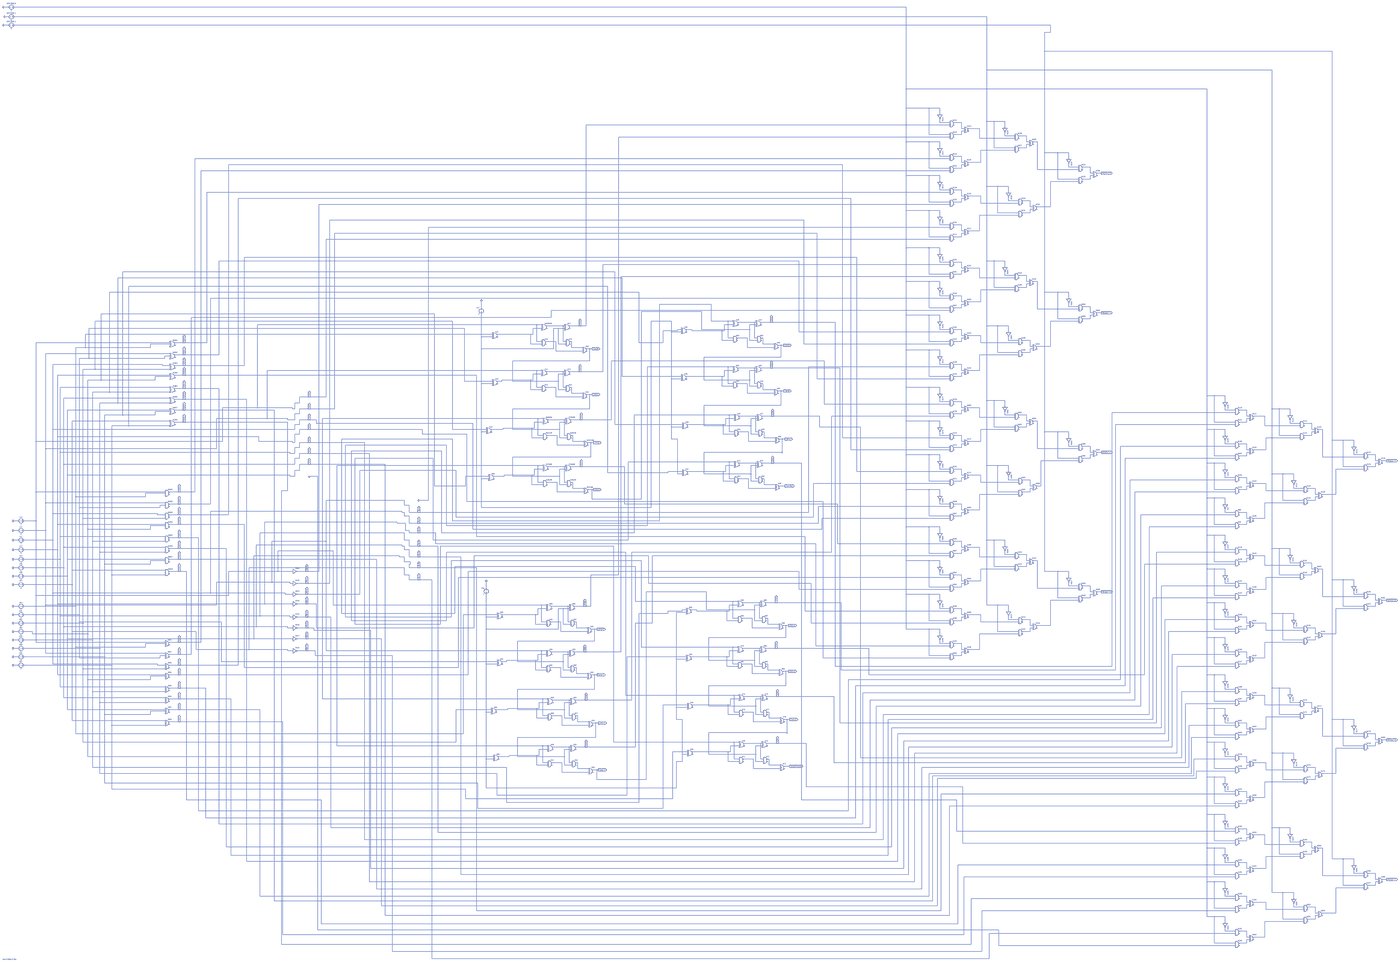
[diagram p0: schematic ALU.asc, whole sheet]
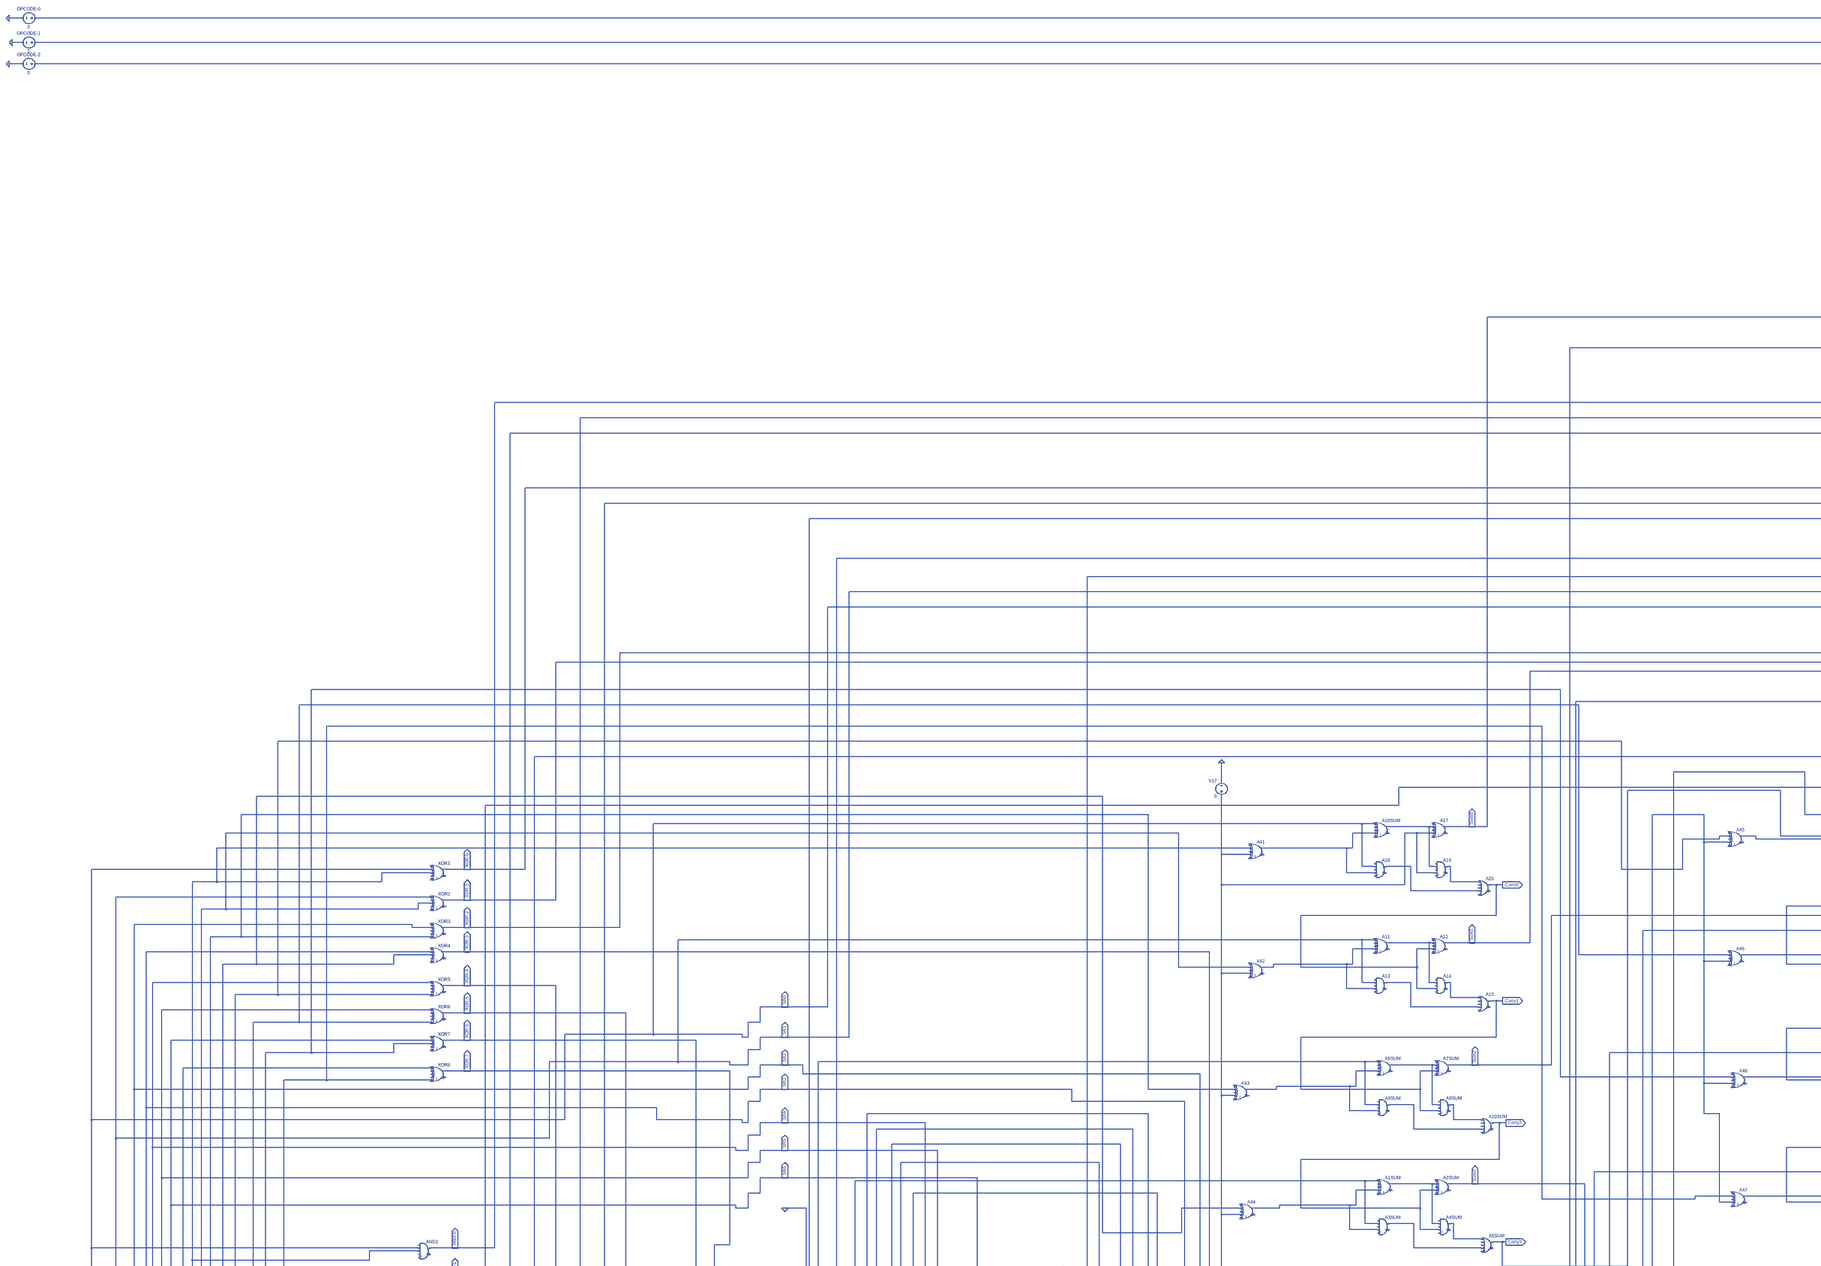
[diagram p1: schematic ALU.asc, part, row 1 of 2, column 1 of 2]
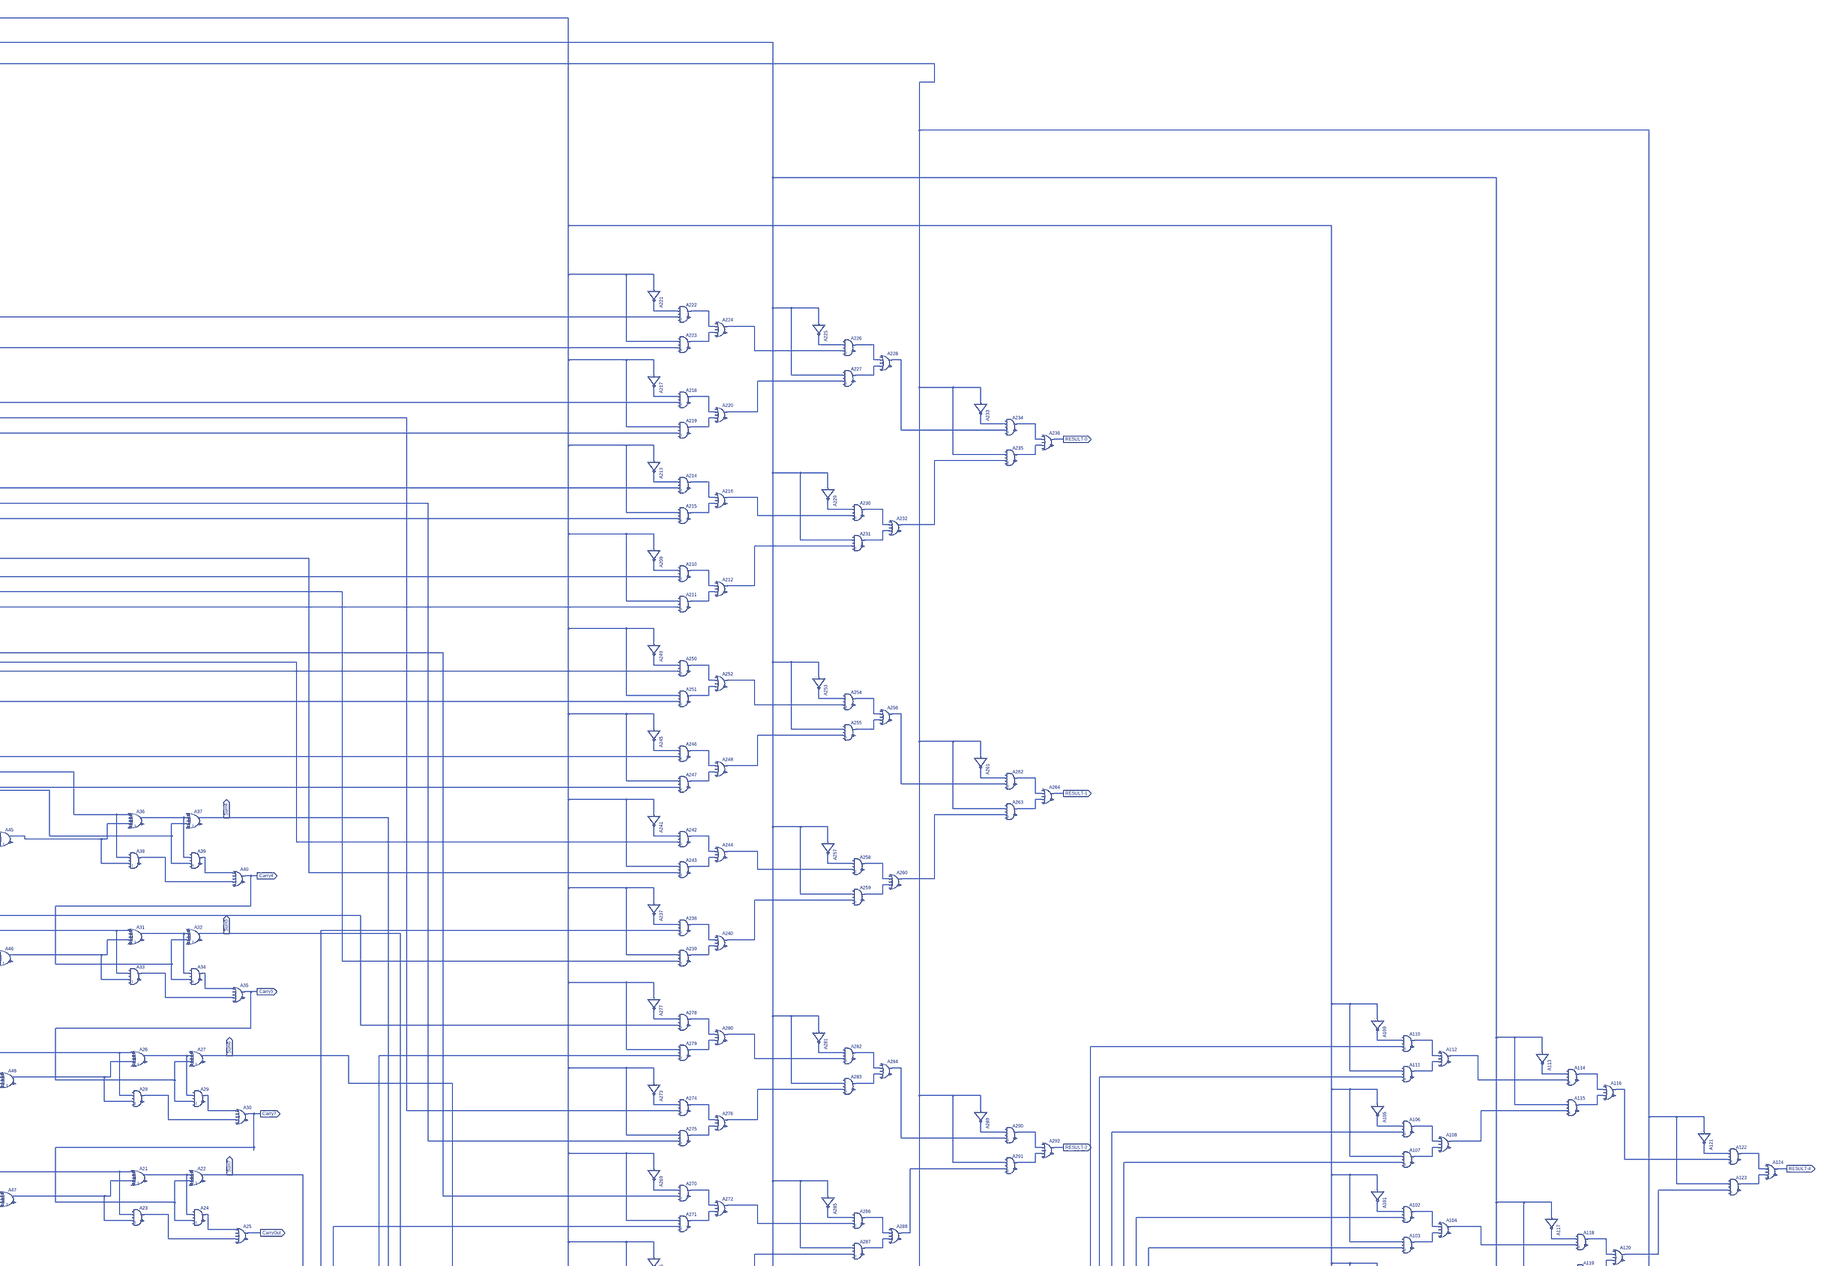
[diagram p2: schematic ALU.asc, part, row 1 of 2, column 2 of 2]
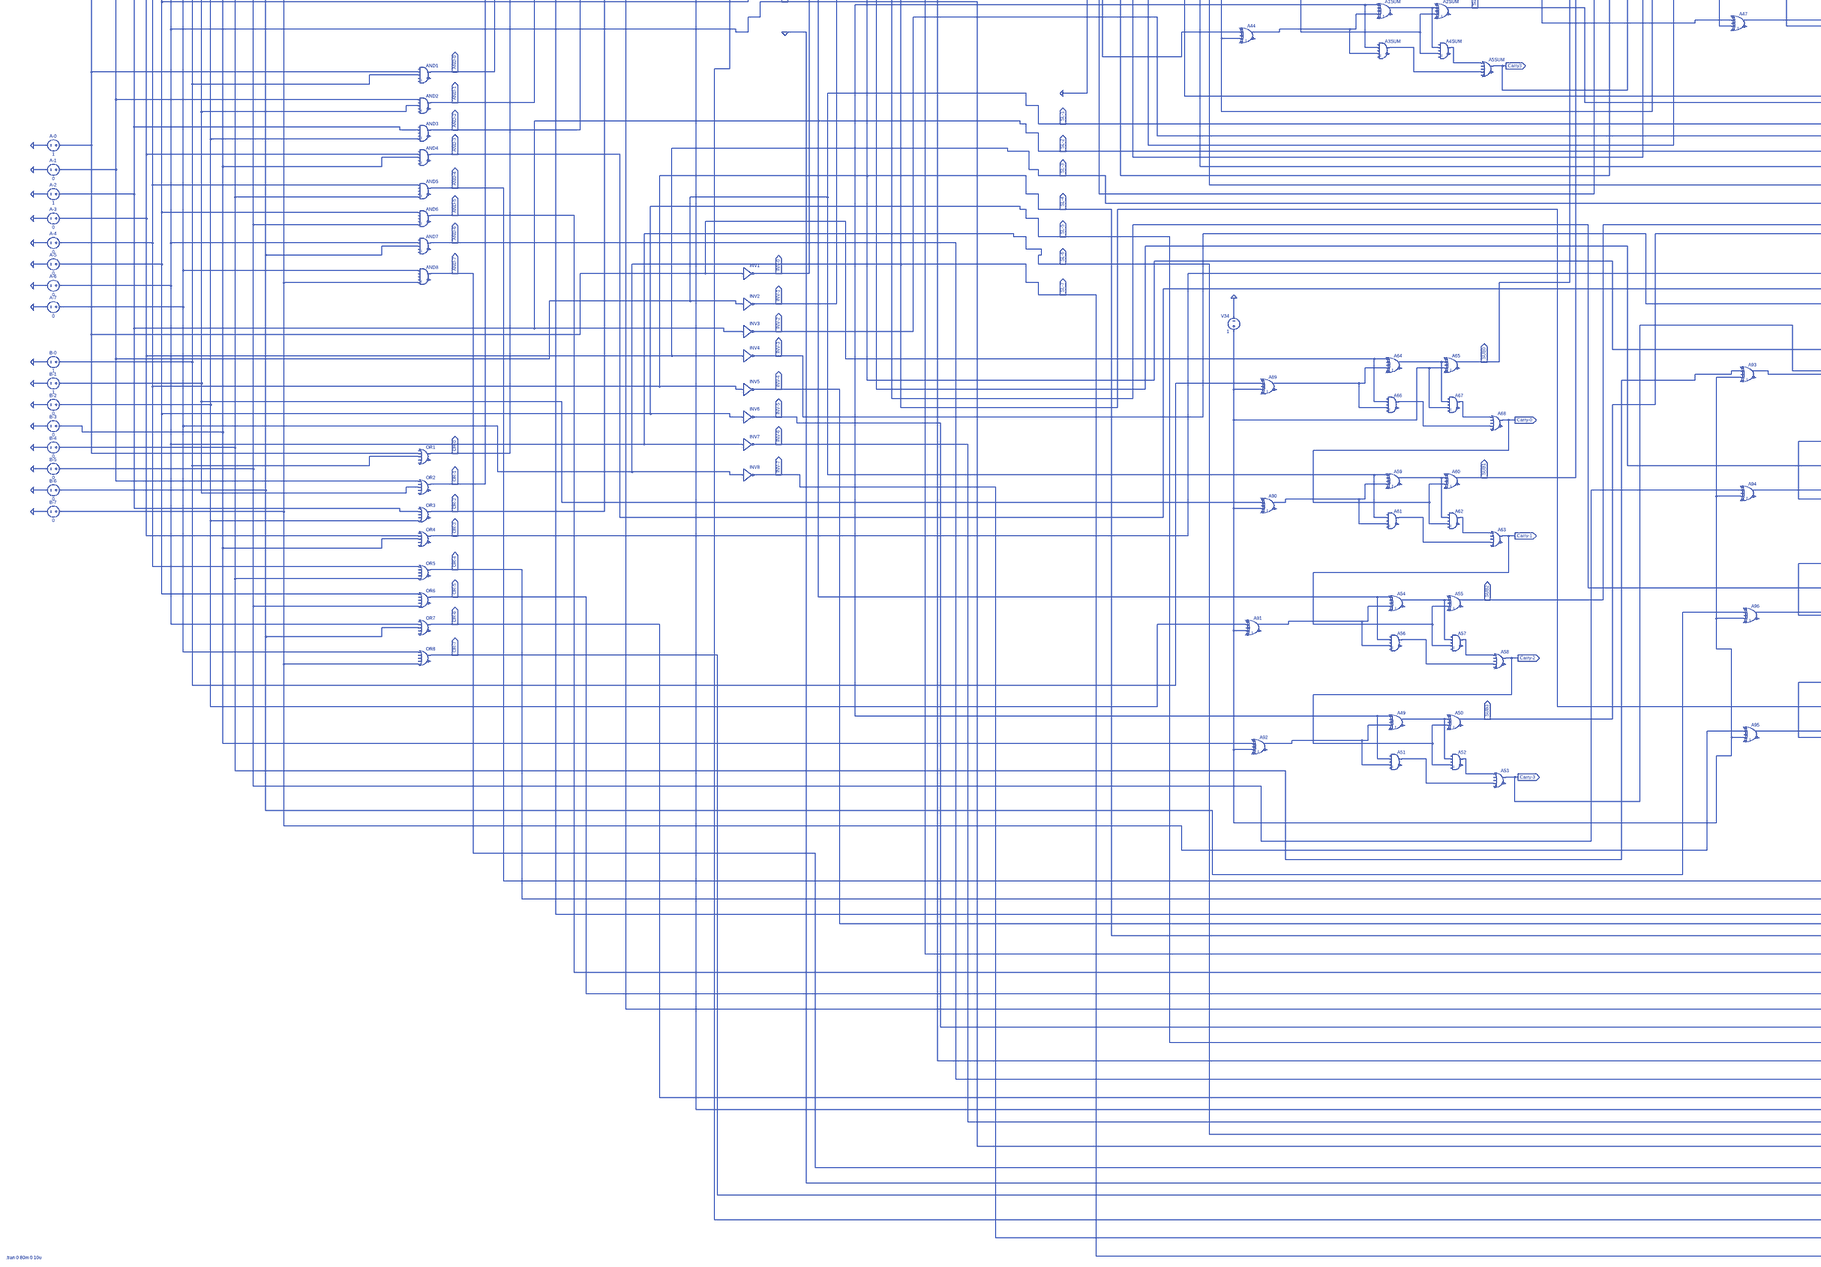
[diagram p3: schematic ALU.asc, part, row 2 of 2, column 1 of 2]
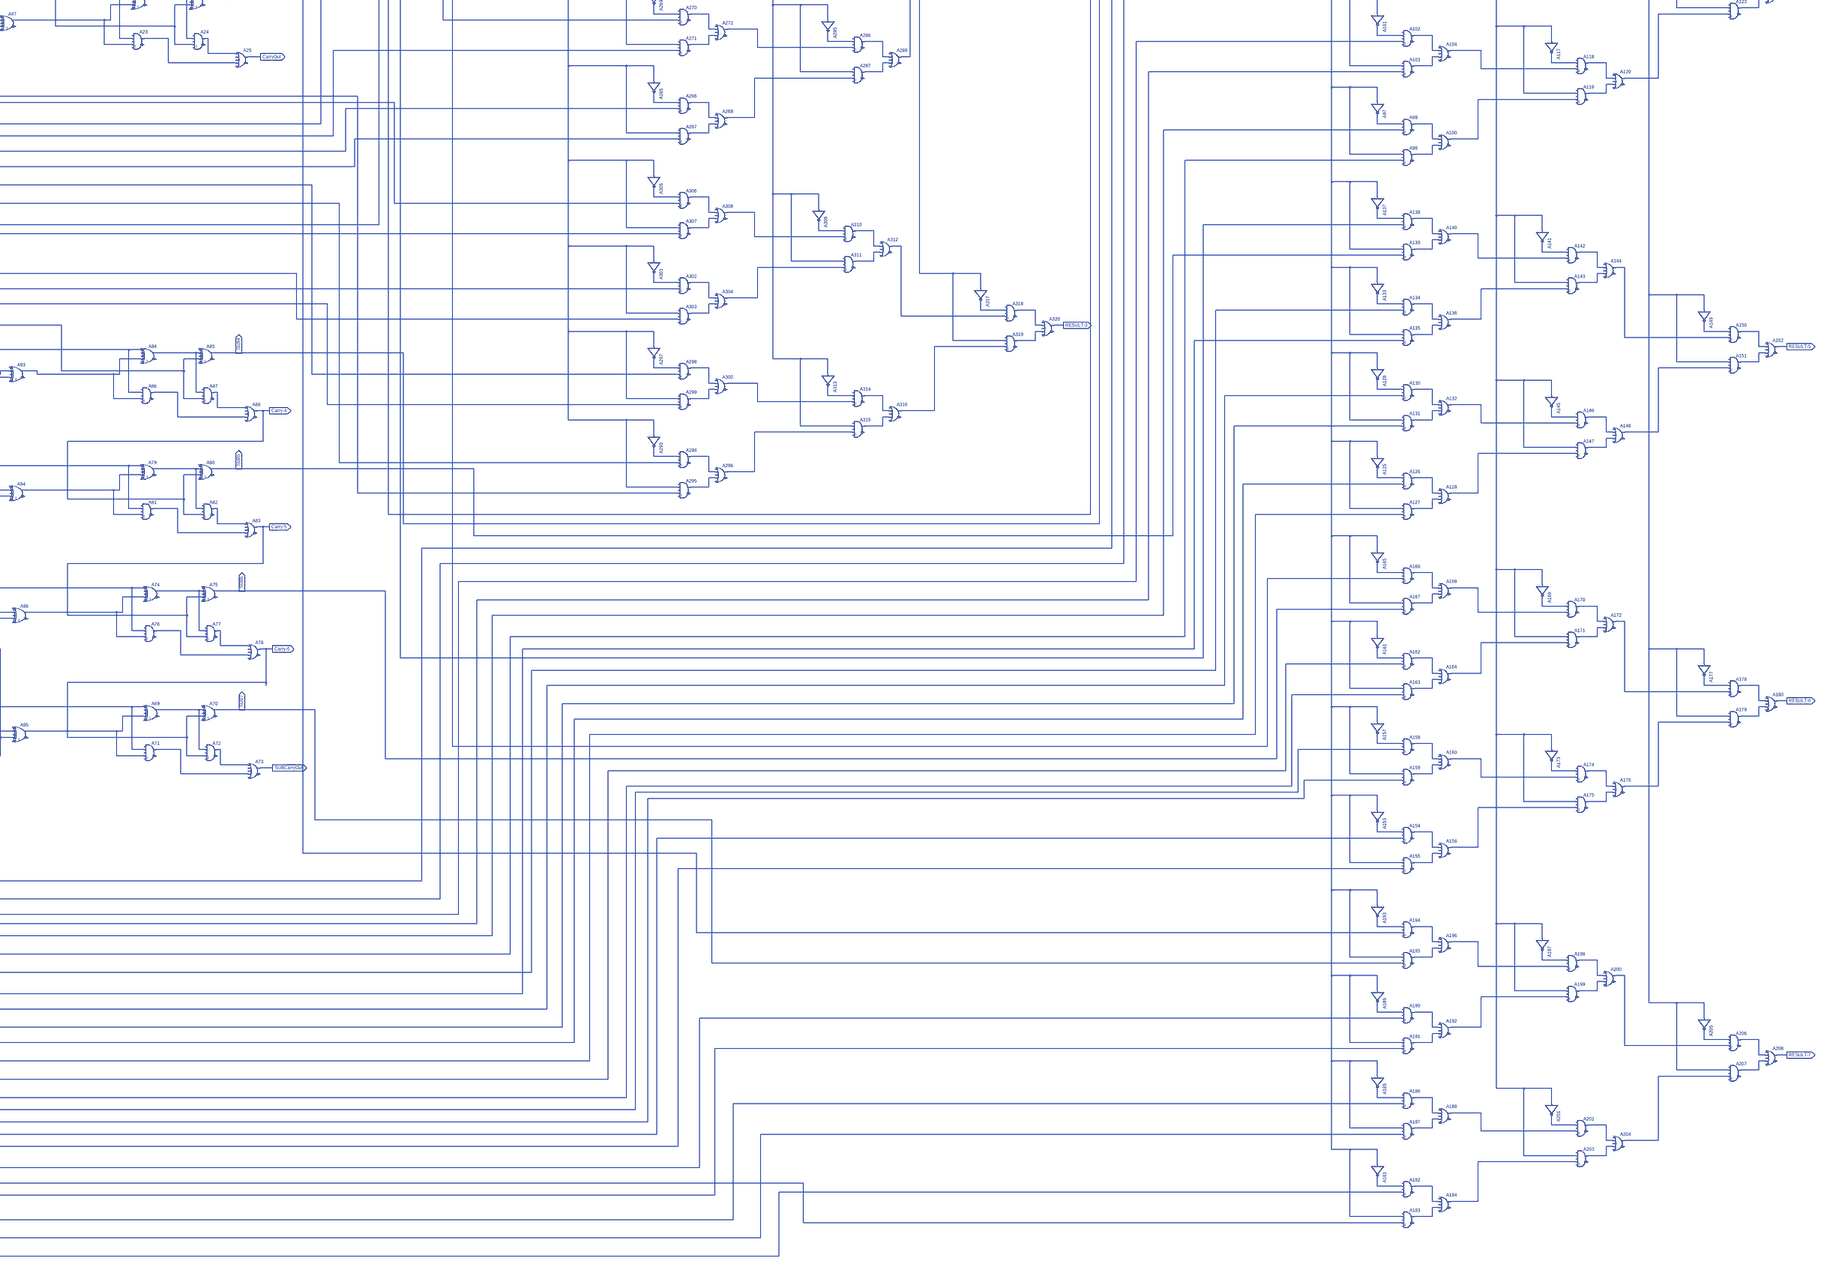
[diagram p4: schematic ALU.asc, part, row 2 of 2, column 2 of 2]
* ALU.asc
A1SUM SL-3 0 0 N124 0 0 N123 0 XOR
A2SUM 0 N123 0 Carry2 0 0 Sum3 0 XOR
A3SUM 0 SL-3 0 N124 0 0 N136 0 AND
A4SUM 0 N123 0 Carry2 0 0 N137 0 AND
A5SUM N137 0 0 N136 0 0 Carry3 0 OR
A6SUM SL-2 0 0 N096 0 0 N094 0 XOR
A7SUM 0 N094 0 Carry1 0 0 Sum2 0 XOR
A8SUM 0 SL-2 0 N096 0 0 N105 0 AND
A9SUM 0 N094 0 Carry1 0 0 N106 0 AND
A10SUM N106 0 0 N105 0 0 Carry2 0 OR
A11 SL-1 0 0 N077 0 0 N075 0 XOR
A12 0 N075 0 Carry0 0 0 Sum1 0 XOR
A13 0 SL-1 0 N077 0 0 N080 0 AND
A14 0 N075 0 Carry0 0 0 N081 0 AND
A15 N081 0 0 N080 0 0 Carry1 0 OR
A16SUM SR0 0 0 N057 0 0 N055 0 XOR
A17 0 N055 0 N051 0 0 Sum0 0 XOR
A18 0 SR0 0 N057 0 0 N067 0 AND
A19 0 N055 0 N051 0 0 N068 0 AND
A20 N068 0 0 N067 0 0 Carry0 0 OR
A21 SL-7 0 0 N122 0 0 N120 0 XOR
A22 0 N120 0 Carry7 0 0 Sum7 0 XOR
A23 0 SL-7 0 N122 0 0 N132 0 AND
A24 0 N120 0 Carry7 0 0 N133 0 AND
A25 N133 0 0 N132 0 0 CarryOut 0 OR
A26 SL-6 0 0 N092 0 0 N090 0 XOR
A27 0 N090 0 Carry5 0 0 Sum6 0 XOR
A28 0 SL-6 0 N092 0 0 N102 0 AND
A29 0 N090 0 Carry5 0 0 N103 0 AND
A30 N103 0 0 N102 0 0 Carry7 0 OR
A31 SL-5 0 0 N074 0 0 N073 0 XOR
A32 0 N073 0 Carry4 0 0 Sum5 0 XOR
A33 0 SL-5 0 N074 0 0 N078 0 AND
A34 0 N073 0 Carry4 0 0 N079 0 AND
A35 N079 0 0 N078 0 0 Carry5 0 OR
A36 SL-4 0 0 N054 0 0 N053 0 XOR
A37 0 N053 0 Carry3 0 0 Sum4 0 XOR
A38 0 SL-4 0 N054 0 0 N062 0 AND
A39 0 N053 0 Carry3 0 0 N063 0 AND
A40 N063 0 0 N062 0 0 Carry4 0 OR
A41 0 N060 0 N051 0 0 N057 0 XOR
A42 0 N056 0 N051 0 0 N077 0 XOR
A43 0 N050 0 N051 0 0 N096 0 XOR
A44 0 N048 0 N051 0 0 N124 0 XOR
A45 0 N042 0 N051 0 0 N054 0 XOR
V17 N051 0 0
A46 0 N037 0 N051 0 0 N074 0 XOR
A47 0 N040 0 N051 0 0 N122 0 XOR
A48 0 N034 0 N051 0 0 N092 0 XOR
A49 SL-3 0 0 N250 0 0 N248 0 XOR
A50 0 N248 0 Carry-2 0 0 SUB3 0 XOR
A51 0 SL-3 0 N250 0 0 N255 0 AND
A52 0 N248 0 Carry-2 0 0 N256 0 AND
A53 N256 0 0 N255 0 0 Carry-3 0 OR
A54 SL-2 0 0 N230 0 0 N229 0 XOR
A55 0 N229 0 Carry-1 0 0 SUB2 0 XOR
A56 0 SL-2 0 N230 0 0 N237 0 AND
A57 0 N229 0 Carry-1 0 0 N238 0 AND
A58 N238 0 0 N237 0 0 Carry-2 0 OR
A59 SL-1 0 0 N217 0 0 N213 0 XOR
A60 0 N213 0 Carry-0 0 0 SUB1 0 XOR
A61 0 SL-1 0 N217 0 0 N221 0 AND
A62 0 N213 0 Carry-0 0 0 N222 0 AND
A63 N222 0 0 N221 0 0 Carry-1 0 OR
A64 SR0 0 0 N186 0 0 N185 0 XOR
A65 0 N185 0 N187 0 0 SUB0 0 XOR
A66 0 SR0 0 N186 0 0 N199 0 AND
A67 0 N185 0 N187 0 0 N200 0 AND
A68 N200 0 0 N199 0 0 Carry-0 0 OR
A69 SL-7 0 0 N247 0 0 N246 0 XOR
A70 0 N246 0 Carry-6 0 0 SUB7 0 XOR
A71 0 SL-7 0 N247 0 0 N253 0 AND
A72 0 N246 0 Carry-6 0 0 N254 0 AND
A73 N254 0 0 N253 0 0 SUBCarryOut 0 OR
A74 SL-6 0 0 N228 0 0 N226 0 XOR
A75 0 N226 0 Carry-5 0 0 SUB6 0 XOR
A76 0 SL-6 0 N228 0 0 N235 0 AND
A77 0 N226 0 Carry-5 0 0 N236 0 AND
A78 N236 0 0 N235 0 0 Carry-6 0 OR
A79 SL-5 0 0 N212 0 0 N211 0 XOR
A80 0 N211 0 Carry-4 0 0 SUB5 0 XOR
A81 0 SL-5 0 N212 0 0 N219 0 AND
A82 0 N211 0 Carry-4 0 0 N220 0 AND
A83 N220 0 0 N219 0 0 Carry-5 0 OR
A84 SL-4 0 0 N184 0 0 N182 0 XOR
A85 0 N182 0 Carry-3 0 0 SUB4 0 XOR
A86 0 SL-4 0 N184 0 0 N195 0 AND
A87 0 N182 0 Carry-3 0 0 N196 0 AND
A88 N196 0 0 N195 0 0 Carry-4 0 OR
A89 0 N060 0 N187 0 0 N186 0 XOR
A90 0 N056 0 N187 0 0 N217 0 XOR
A91 0 N050 0 N187 0 0 N230 0 XOR
A92 0 N048 0 N187 0 0 N250 0 XOR
A93 0 N042 0 N187 0 0 N184 0 XOR
V34 N187 0 1
A94 0 N037 0 N187 0 0 N212 0 XOR
A95 0 N040 0 N187 0 0 N247 0 XOR
A96 0 N034 0 N187 0 0 N228 0 XOR
A§XOR1 0 SR0 N060 0 0 0 XOR-0 0 XOR
A§XOR2 SL-1 0 N056 0 0 0 XOR-1 0 XOR
A§XOR3 0 SL-2 0 0 N050 0 XOR-2 0 XOR
A§XOR4 0 SL-3 N048 0 0 0 XOR-3 0 XOR
A§XOR5 SL-4 0 0 0 N042 0 XOR-4 0 XOR
A§XOR6 SL-5 0 0 0 N037 0 XOR-5 0 XOR
A§XOR7 0 SL-6 N034 0 0 0 XOR-6 0 XOR
A§XOR8 SL-7 0 0 0 N040 0 XOR-7 0 XOR
AND1 0 SR0 N060 0 0 0 AND-0 0 AND
AND2 SL-1 0 N056 0 0 0 AND-1 0 AND
AND3 0 SL-2 0 0 N050 0 AND-2 0 AND
AND4 0 SL-3 N048 0 0 0 AND-3 0 AND
AND5 SL-4 0 0 0 N042 0 AND-4 0 AND
AND6 SL-5 0 0 0 N037 0 AND-5 0 AND
AND7 0 SL-6 N034 0 0 0 AND-6 0 AND
AND8 SL-7 0 0 0 N040 0 AND-7 0 AND
A§OR1 0 SR0 N060 0 0 0 OR-0 0 OR
A§OR2 SL-1 0 N056 0 0 0 OR-1 0 OR
A§OR3 0 SL-2 0 0 N050 0 OR-2 0 OR
A§OR4 0 SL-3 N048 0 0 0 OR-3 0 OR
A§OR5 SL-4 0 0 0 N042 0 OR-4 0 OR
A§OR6 SL-5 0 0 0 N037 0 OR-5 0 OR
A§OR7 0 SL-6 N034 0 0 0 OR-6 0 OR
A§OR8 SL-7 0 0 0 N040 0 OR-7 0 OR
A§INV1 SR0 0 0 0 0 INV-0 0 0 BUF
A§INV2 SL-1 0 0 0 0 INV-1 0 0 BUF
A§INV3 SL-2 0 0 0 0 INV-2 0 0 BUF
A§INV4 SL-3 0 0 0 0 INV-3 0 0 BUF
A§INV5 SL-4 0 0 0 0 INV-4 0 0 BUF
A§INV6 SL-5 0 0 0 0 INV-5 0 0 BUF
A§INV7 SL-6 0 0 0 0 INV-6 0 0 BUF
A§INV8 SL-7 0 0 0 0 INV-7 0 0 BUF
V§A-1 SL-1 0 0
V§A-2 SL-2 0 1
V§A-3 SL-3 0 0
V§A-4 SL-4 0 0
V§A-5 SL-5 0 0
V§A-6 SL-6 0 0
V§A-7 SL-7 0 0
V§B-0 N060 0 1
V§B-1 N056 0 1
V§B-2 N050 0 0
V§B-3 N048 0 0
V§B-4 N042 0 0
V§B-5 N037 0 0
V§B-6 N034 0 0
V§B-7 N040 0 0
V§OPCODE-2 N002 0 0
V§OPCODE-1 N001 0 1
V§OPCODE-0 AND-4 0 0
A97 AND-4 0 0 0 0 N149 0 0 BUF
A98 0 N149 0 SL-4 0 0 N150 0 AND
A99 0 AND-4 0 SL-4 0 0 N151 0 AND
A100 0 N150 0 N151 0 0 N145 0 OR
A101 AND-4 0 0 0 0 N130 0 0 BUF
A102 0 N130 0 XOR-4 0 0 N131 0 AND
A103 0 AND-4 0 INV-4 0 0 N139 0 AND
A104 0 N131 0 N139 0 0 N138 0 OR
A105 AND-4 0 0 0 0 N111 0 0 BUF
A106 0 N111 0 AND-4 0 0 N112 0 AND
A107 0 AND-4 0 OR-4 0 0 N115 0 AND
A108 0 N112 0 N115 0 0 N109 0 OR
A109 AND-4 0 0 0 0 N086 0 0 BUF
A110 0 N086 0 Sum4 0 0 N087 0 AND
A111 0 AND-4 0 SUB4 0 0 N093 0 AND
A112 0 N087 0 N093 0 0 N091 0 OR
A113 N001 0 0 0 0 N098 0 0 BUF
A114 0 N098 0 N091 0 0 N099 0 AND
A115 0 N001 0 N109 0 0 N104 0 AND
A116 0 N099 0 N104 0 0 N101 0 OR
A117 N001 0 0 0 0 N141 0 0 BUF
A118 0 N141 0 N138 0 0 N142 0 AND
A119 0 N001 0 N145 0 0 N144 0 AND
A120 0 N142 0 N144 0 0 N127 0 OR
A121 N002 0 0 0 0 N117 0 0 BUF
A122 0 N117 0 N101 0 0 N118 0 AND
A123 0 N002 0 N127 0 0 N121 0 AND
A124 0 N118 0 N121 0 0 RESULT-4 0 OR
A125 AND-4 0 0 0 0 N215 0 0 BUF
A126 0 N215 0 SL-5 0 0 N216 0 AND
A127 0 AND-4 0 SL-5 0 0 N218 0 AND
A128 0 N216 0 N218 0 0 N208 0 OR
A129 AND-4 0 0 0 0 N193 0 0 BUF
A130 0 N193 0 XOR-5 0 0 N194 0 AND
A131 0 AND-4 0 INV-5 0 0 N202 0 AND
A132 0 N194 0 N202 0 0 N201 0 OR
A133 AND-4 0 0 0 0 N173 0 0 BUF
A134 0 N173 0 AND-5 0 0 N174 0 AND
A135 0 AND-4 0 OR-5 0 0 N177 0 AND
A136 0 N174 0 N177 0 0 N171 0 OR
A137 AND-4 0 0 0 0 N156 0 0 BUF
A138 0 N156 0 Sum5 0 0 N157 0 AND
A139 0 AND-4 0 SUB5 0 0 N161 0 AND
A140 0 N157 0 N161 0 0 N160 0 OR
A141 N001 0 0 0 0 N164 0 0 BUF
A142 0 N164 0 N160 0 0 N165 0 AND
A143 0 N001 0 N171 0 0 N168 0 AND
A144 0 N165 0 N168 0 0 N167 0 OR
A145 N001 0 0 0 0 N204 0 0 BUF
A146 0 N204 0 N201 0 0 N205 0 AND
A147 0 N001 0 N208 0 0 N207 0 AND
A148 0 N205 0 N207 0 0 N190 0 OR
A149 N002 0 0 0 0 N179 0 0 BUF
A150 0 N179 0 N167 0 0 N180 0 AND
A151 0 N002 0 N190 0 0 N183 0 AND
A152 0 N180 0 N183 0 0 RESULT-5 0 OR
A153 AND-4 0 0 0 0 N263 0 0 BUF
A154 0 N263 0 SL-6 0 0 N264 0 AND
A155 0 AND-4 0 SL-6 0 0 N265 0 AND
A156 0 N264 0 N265 0 0 N262 0 OR
A157 AND-4 0 0 0 0 N251 0 0 BUF
A158 0 N251 0 XOR-6 0 0 N252 0 AND
A159 0 AND-4 0 INV-6 0 0 N258 0 AND
A160 0 N252 0 N258 0 0 N257 0 OR
A161 AND-4 0 0 0 0 N240 0 0 BUF
A162 0 N240 0 AND-6 0 0 N241 0 AND
A163 0 AND-4 0 OR-6 0 0 N242 0 AND
A164 0 N241 0 N242 0 0 N239 0 OR
A165 AND-4 0 0 0 0 N223 0 0 BUF
A166 0 N223 0 Sum6 0 0 N224 0 AND
A167 0 AND-4 0 SUB6 0 0 N227 0 AND
A168 0 N224 0 N227 0 0 N225 0 OR
A169 N001 0 0 0 0 N231 0 0 BUF
A170 0 N231 0 N225 0 0 N232 0 AND
A171 0 N001 0 N239 0 0 N234 0 AND
A172 0 N232 0 N234 0 0 N233 0 OR
A173 N001 0 0 0 0 N259 0 0 BUF
A174 0 N259 0 N257 0 0 N260 0 AND
A175 0 N001 0 N262 0 0 N261 0 AND
A176 0 N260 0 N261 0 0 N249 0 OR
A177 N002 0 0 0 0 N243 0 0 BUF
A178 0 N243 0 N233 0 0 N244 0 AND
A179 0 N002 0 N249 0 0 N245 0 AND
A180 0 N244 0 N245 0 0 RESULT-6 0 OR
A181 AND-4 0 0 0 0 N290 0 0 BUF
A182 0 N290 0 SL-7 0 0 N291 0 AND
A183 0 AND-4 0 0 0 0 N292 0 AND
A184 0 N291 0 N292 0 0 N289 0 OR
A185 AND-4 0 0 0 0 N282 0 0 BUF
A186 0 N282 0 XOR-7 0 0 N283 0 AND
A187 0 AND-4 0 INV-7 0 0 N285 0 AND
A188 0 N283 0 N285 0 0 N284 0 OR
A189 AND-4 0 0 0 0 N275 0 0 BUF
A190 0 N275 0 AND-7 0 0 N276 0 AND
A191 0 AND-4 0 OR-7 0 0 N277 0 AND
A192 0 N276 0 N277 0 0 N274 0 OR
A193 AND-4 0 0 0 0 N266 0 0 BUF
A194 0 N266 0 Sum7 0 0 N267 0 AND
A195 0 AND-4 0 SUB7 0 0 N269 0 AND
A196 0 N267 0 N269 0 0 N268 0 OR
A197 N001 0 0 0 0 N270 0 0 BUF
A198 0 N270 0 N268 0 0 N271 0 AND
A199 0 N001 0 N274 0 0 N273 0 AND
A200 0 N271 0 N273 0 0 N272 0 OR
A201 N001 0 0 0 0 N286 0 0 BUF
A202 0 N286 0 N284 0 0 N287 0 AND
A203 0 N001 0 N289 0 0 N288 0 AND
A204 0 N287 0 N288 0 0 N281 0 OR
A205 N002 0 0 0 0 N278 0 0 BUF
A206 0 N278 0 N272 0 0 N279 0 AND
A207 0 N002 0 N281 0 0 N280 0 AND
A208 0 N279 0 N280 0 0 RESULT-7 0 OR
A209 AND-4 0 0 0 0 N027 0 0 BUF
A210 0 N027 0 0 0 0 N028 0 AND
A211 0 AND-4 0 SR0 0 0 N029 0 AND
A212 0 N028 0 N029 0 0 N026 0 OR
A213 AND-4 0 0 0 0 N019 0 0 BUF
A214 0 N019 0 XOR-0 0 0 N020 0 AND
A215 0 AND-4 0 INV-0 0 0 N022 0 AND
A216 0 N020 0 N022 0 0 N021 0 OR
A217 AND-4 0 0 0 0 N012 0 0 BUF
A218 0 N012 0 AND-0 0 0 N013 0 AND
A219 0 AND-4 0 OR-0 0 0 N014 0 AND
A220 0 N013 0 N014 0 0 N011 0 OR
A221 AND-4 0 0 0 0 N003 0 0 BUF
A222 0 N003 0 Sum0 0 0 N004 0 AND
A223 0 AND-4 0 SUB0 0 0 N006 0 AND
A224 0 N004 0 N006 0 0 N005 0 OR
A225 N001 0 0 0 0 N007 0 0 BUF
A226 0 N007 0 N005 0 0 N008 0 AND
A227 0 N001 0 N011 0 0 N010 0 AND
A228 0 N008 0 N010 0 0 N009 0 OR
A229 N001 0 0 0 0 N023 0 0 BUF
A230 0 N023 0 N021 0 0 N024 0 AND
A231 0 N001 0 N026 0 0 N025 0 AND
A232 0 N024 0 N025 0 0 N018 0 OR
A233 N002 0 0 0 0 N015 0 0 BUF
A234 0 N015 0 N009 0 0 N016 0 AND
A235 0 N002 0 N018 0 0 N017 0 AND
A236 0 N016 0 N017 0 0 RESULT-0 0 OR
A237 AND-4 0 0 0 0 N071 0 0 BUF
A238 0 N071 0 SL-1 0 0 N072 0 AND
A239 0 AND-4 0 SL-1 0 0 N076 0 AND
A240 0 N072 0 N076 0 0 N070 0 OR
A241 AND-4 0 0 0 0 N058 0 0 BUF
A242 0 N058 0 XOR-1 0 0 N059 0 AND
A243 0 AND-4 0 INV-1 0 0 N064 0 AND
A244 0 N059 0 N064 0 0 N061 0 OR
A245 AND-4 0 0 0 0 N043 0 0 BUF
A246 0 N043 0 AND-1 0 0 N044 0 AND
A247 0 AND-4 0 OR-1 0 0 N045 0 AND
A248 0 N044 0 N045 0 0 N041 0 OR
A249 AND-4 0 0 0 0 N030 0 0 BUF
A250 0 N030 0 Sum1 0 0 N031 0 AND
A251 0 AND-4 0 SUB1 0 0 N033 0 AND
A252 0 N031 0 N033 0 0 N032 0 OR
A253 N001 0 0 0 0 N035 0 0 BUF
A254 0 N035 0 N032 0 0 N036 0 AND
A255 0 N001 0 N041 0 0 N039 0 AND
A256 0 N036 0 N039 0 0 N038 0 OR
A257 N001 0 0 0 0 N065 0 0 BUF
A258 0 N065 0 N061 0 0 N066 0 AND
A259 0 N001 0 N070 0 0 N069 0 AND
A260 0 N066 0 N069 0 0 N052 0 OR
A261 N002 0 0 0 0 N046 0 0 BUF
A262 0 N046 0 N038 0 0 N047 0 AND
A263 0 N002 0 N052 0 0 N049 0 AND
A264 0 N047 0 N049 0 0 RESULT-1 0 OR
A265 AND-4 0 0 0 0 N146 0 0 BUF
A266 0 N146 0 SL-2 0 0 N147 0 AND
A267 0 AND-4 0 SL-2 0 0 N148 0 AND
A268 0 N147 0 N148 0 0 N143 0 OR
A269 AND-4 0 0 0 0 N125 0 0 BUF
A270 0 N125 0 XOR-2 0 0 N126 0 AND
A271 0 AND-4 0 INV-2 0 0 N129 0 AND
A272 0 N126 0 N129 0 0 N128 0 OR
A273 AND-4 0 0 0 0 N107 0 0 BUF
A274 0 N107 0 AND-2 0 0 N108 0 AND
A275 0 AND-4 0 OR-2 0 0 N110 0 AND
A276 0 N108 0 N110 0 0 N100 0 OR
A277 AND-4 0 0 0 0 N082 0 0 BUF
A278 0 N082 0 Sum2 0 0 N083 0 AND
A279 0 AND-4 0 SUB2 0 0 N085 0 AND
A280 0 N083 0 N085 0 0 N084 0 OR
A281 N001 0 0 0 0 N088 0 0 BUF
A282 0 N088 0 N084 0 0 N089 0 AND
A283 0 N001 0 N100 0 0 N097 0 AND
A284 0 N089 0 N097 0 0 N095 0 OR
A285 N001 0 0 0 0 N134 0 0 BUF
A286 0 N134 0 N128 0 0 N135 0 AND
A287 0 N001 0 N143 0 0 N140 0 AND
A288 0 N135 0 N140 0 0 N119 0 OR
A289 N002 0 0 0 0 N113 0 0 BUF
A290 0 N113 0 N095 0 0 N114 0 AND
A291 0 N002 0 N119 0 0 N116 0 AND
A292 0 N114 0 N116 0 0 RESULT-2 0 OR
A293 AND-4 0 0 0 0 N209 0 0 BUF
A294 0 N209 0 SL-3 0 0 N210 0 AND
A295 0 AND-4 0 SL-3 0 0 N214 0 AND
A296 0 N210 0 N214 0 0 N206 0 OR
A297 AND-4 0 0 0 0 N188 0 0 BUF
A298 0 N188 0 XOR-3 0 0 N189 0 AND
A299 0 AND-4 0 INV-3 0 0 N192 0 AND
A300 0 N189 0 N192 0 0 N191 0 OR
A301 AND-4 0 0 0 0 N169 0 0 BUF
A302 0 N169 0 AND-3 0 0 N170 0 AND
A303 0 AND-4 0 OR-3 0 0 N172 0 AND
A304 0 N170 0 N172 0 0 N166 0 OR
A305 AND-4 0 0 0 0 N152 0 0 BUF
A306 0 N152 0 Sum3 0 0 N153 0 AND
A307 0 AND-4 0 SUB3 0 0 N155 0 AND
A308 0 N153 0 N155 0 0 N154 0 OR
A309 N001 0 0 0 0 N158 0 0 BUF
A310 0 N158 0 N154 0 0 N159 0 AND
A311 0 N001 0 N166 0 0 N163 0 AND
A312 0 N159 0 N163 0 0 N162 0 OR
A313 N001 0 0 0 0 N197 0 0 BUF
A314 0 N197 0 N191 0 0 N198 0 AND
A315 0 N001 0 N206 0 0 N203 0 AND
A316 0 N198 0 N203 0 0 N181 0 OR
A317 N002 0 0 0 0 N175 0 0 BUF
A318 0 N175 0 N162 0 0 N176 0 AND
A319 0 N002 0 N181 0 0 N178 0 AND
A320 0 N176 0 N178 0 0 RESULT-3 0 OR
V§A-0 SR0 0 1
.tran 0 80m 0 10u
.backanno
.end